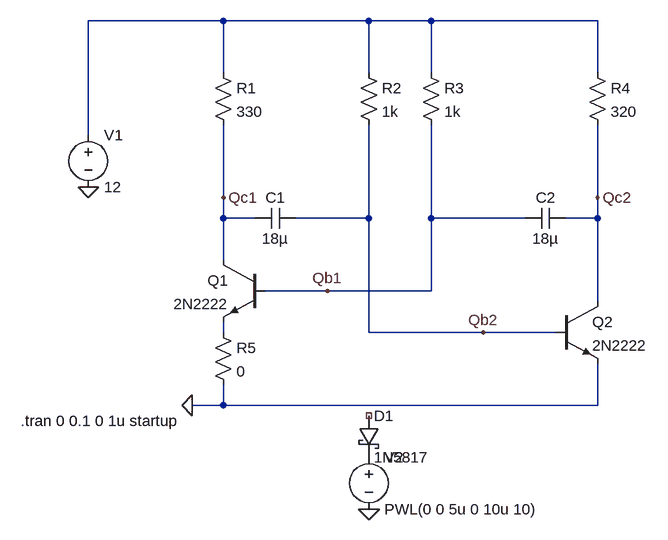
[diagram p0: schematic Multivibrator.asc]
Multivibrator.asc, the LTspice schematic file:
Version 4
SHEET 1 880 680
WIRE -112 -240 -320 -240
WIRE 112 -240 -112 -240
WIRE 208 -240 112 -240
WIRE 464 -240 208 -240
WIRE -112 -160 -112 -240
WIRE 112 -160 112 -240
WIRE 208 -160 208 -240
WIRE 464 -160 464 -240
WIRE -320 -64 -320 -240
WIRE -112 32 -112 -80
WIRE 464 32 464 -80
WIRE -112 64 -112 32
WIRE -64 64 -112 64
WIRE 112 64 112 -80
WIRE 112 64 0 64
WIRE 208 64 208 -80
WIRE 352 64 208 64
WIRE 464 64 464 32
WIRE 464 64 416 64
WIRE -112 128 -112 64
WIRE 48 176 -48 176
WIRE 208 176 208 64
WIRE 208 176 48 176
WIRE 464 192 464 64
WIRE -112 240 -112 224
WIRE 112 240 112 64
WIRE 288 240 112 240
WIRE 400 240 288 240
WIRE -112 352 -112 320
WIRE -112 352 -160 352
WIRE 464 352 464 288
WIRE 464 352 -112 352
FLAG -160 352 0
FLAG -320 16 0
FLAG 112 512 0
FLAG -112 32 Qc1
FLAG 464 32 Qc2
FLAG 48 176 Qb1
FLAG 288 240 Qb2
SYMBOL cap 0 48 R90
WINDOW 0 0 32 VBottom 2
WINDOW 3 32 32 VTop 2
SYMATTR InstName C1
SYMATTR Value 18µ
SYMBOL cap 416 48 R90
WINDOW 0 0 32 VBottom 2
WINDOW 3 32 32 VTop 2
SYMATTR InstName C2
SYMATTR Value 18µ
SYMBOL res -128 -176 R0
SYMATTR InstName R1
SYMATTR Value 330
SYMBOL res 96 -176 R0
SYMATTR InstName R2
SYMATTR Value 1k
SYMBOL res 192 -176 R0
SYMATTR InstName R3
SYMATTR Value 1k
SYMBOL res 448 -176 R0
SYMATTR InstName R4
SYMATTR Value 320
SYMBOL voltage -320 -80 R0
WINDOW 123 0 0 Left 0
WINDOW 39 0 0 Left 0
SYMATTR InstName V1
SYMATTR Value 12
SYMBOL voltage 112 416 R0
WINDOW 123 0 0 Left 0
WINDOW 39 0 0 Left 0
SYMATTR InstName V2
SYMATTR Value PWL(0 0 5u 0 10u 10)
SYMBOL schottky 96 368 R0
SYMATTR InstName D1
SYMATTR Value 1N5817
SYMATTR Description Diode
SYMATTR Type diode
SYMBOL npn -48 128 M0
SYMATTR InstName Q1
SYMATTR Value 2N2222
SYMBOL npn 400 192 R0
SYMATTR InstName Q2
SYMATTR Value 2N2222
SYMBOL res -128 224 R0
SYMATTR InstName R5
SYMATTR Value 0
TEXT -424 376 Left 2 !.tran 0 0.1 0 1u startup

The netlist it stands for:
* Multivibrator.asc
C1 Qb2 Qc1 18µ
C2 Qc2 Qb1 18µ
R1 N001 Qc1 330
R2 N001 Qb2 1k
R3 N001 Qb1 1k
R4 N001 Qc2 320
V1 N001 0 12
V2 P001 0 PWL(0 0 5u 0 10u 10)
D1 NC_01 P001 1N5817
Q1 Qc1 Qb1 N002 0 2N2222
Q2 Qc2 Qb2 0 0 2N2222
R5 N002 0 0
.model D D
.lib standard.dio
.model NPN NPN
.model PNP PNP
.lib standard.bjt
.tran 0 0.1 0 1u startup
.backanno
.end